# EAGLE design FM-Radio-Simple-Receiver-Dip1 (EAGLE 7.2.0)
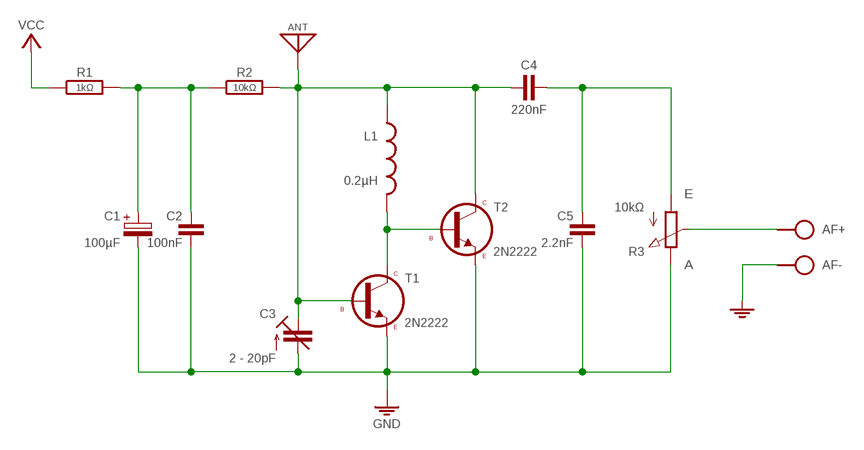
[diagram p0: schematic, sheet 1]

## Parts
AF  SPAD+--+  [SPAD-+]
ANT  ANT  [SPAD]
BAT  VCC_GNDL  [SPAD-+]
C1  100µF  CPOLE2,5-5/V  [E2,5-5/V]
C2  100nF  C050-020X036/V  [C050-020X036/V]
C3  2 - 20pF  C-TR-PH201272222-808-2PIND  [TRIM-2222-808]
C4  220nF  C-H050-020X044  [C050-020X044]
C5  2.2nF  C050-020X036/V  [C050-020X036/V]
L1  0.2µH  L10/10Y  [L-10/10Y]
R1  1kΩ  R-H0204/10  [0204/10]
R2  10kΩ  R-H0204/10  [0204/10]
R3  10kΩ  POT-3P  [CONN-3P]
T1  2N2222  [TO92]
T2  2N2222  [TO92]

## Nets
GND: AF.1 BAT.1 C1.- C2.2 C3.2(A) C5.2 R3.3(E) T1.1(E) T2.1(E)
N$1: ANT.1 C3.3(E) C4.1 L1.P$1 R2.2 T1.2(B) T2.3(C)
N$2: C1.+ C2.1 R1.2 R2.1
N$3: C4.2 C5.1 R3.1(A)
N$5: L1.P$2 T1.3(C) T2.2(B)
N$6: AF.2 R3.2(S)
VCC: BAT.2 R1.1

## Library data of the parts
AF = pad:SPAD+-
ANT = pad:ANT
BAT = pad:VCC_GND
C1 = c:CPOL: POLARIZED CAPACITOR, European symbol
C2 C5 = c:C: CAPACITOR, European symbol
C3 = cap-trim:C-TR-PH20127
C4 = c:C-H
L1 = l:L: Potentiometers Beckman, Copal, Piher, Spectrol, Schukat Created by librarian@cadsoft.de
R1 R2 = r:R-H
R3 = r:POT
T1 T2 = t:2N2222

## Net classes
0 default: width 0.813 mm, clearance 0.813 mm

## Board
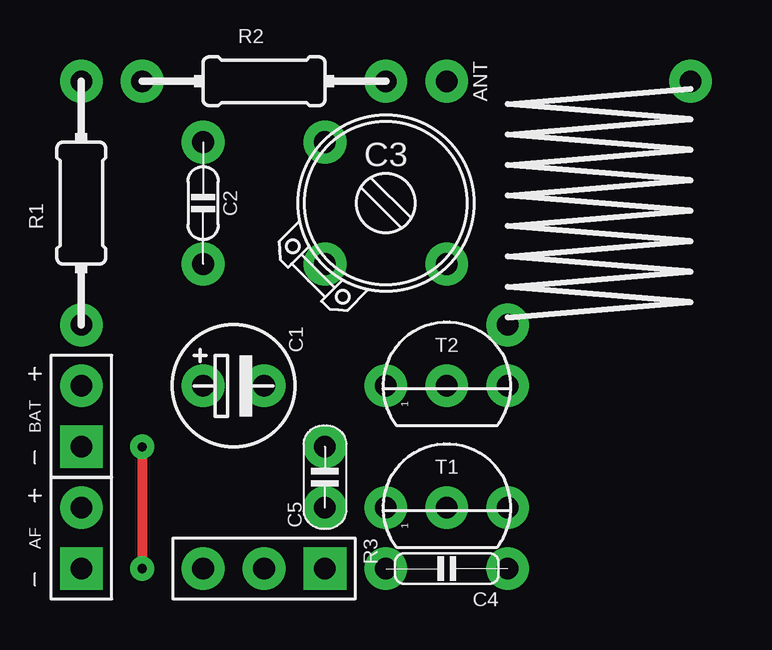
[diagram p1: board, top side]
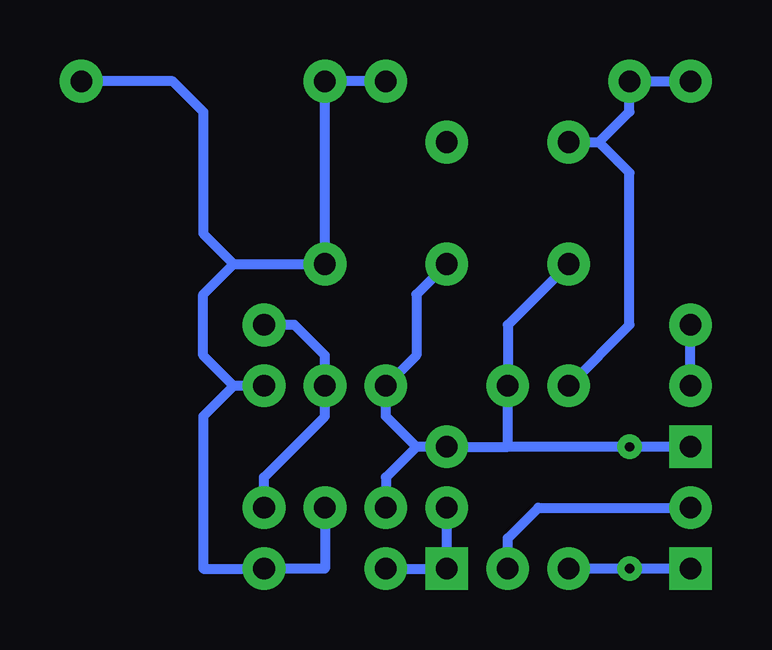
[diagram p2: board, bottom side, seen from below]

No outline drawn. Coordinates in mm, seen from the top.
Copper layers (1*16): Top 0.035mm / dielectric 1.5mm / Bottom 0.035mm
Design rules "default *": minimum track width 10mil, minimum drill 0.61mm, track to track 8mil, track to pad 8mil, pad to pad 8mil, via to via 8mil, smd to smd 8mil, copper to edge 40mil, drill to drill 8mil, minimum pad ring 0mil, minimum via ring 8mil, stop-mask expansion 2mil, vias tented up to drill 15mil, thermal gap 10mil

### Footprints (pad centres in the part's own frame; a part is rotated, then mirrored left to right if it is on the bottom)
SPAD-+ = drill 0.9 pad 1.778 square: 1 0,-1.27 | drill 0.9 pad 1.778: 2 0,1.27
SPAD = drill 0.9 pad 1.778: 1 0,0
E2,5-5/V = drill 0.9 pad 1.778: + 0,-1.27; - 0,1.27
C050-020X036/V = drill 0.9 pad 1.778: 1 0,-2.54; 2 0,2.54
TRIM-2222-808 = drill 0.9 pad 1.778: 1 -2.54,2.54; 2 -2.54,-2.54; 3 2.54,-2.54
C050-020X044 = drill 0.9 pad 1.778: 1 -2.54,0; 2 2.54,0
C025-020X036 = drill 0.9 pad 1.778: 1 0,0; 2 2.54,0
L-10/10Y = drill 0.9 pad 1.778: P$1 5.08,2.54; P$2 -2.54,-7.62
0204/10 = drill 0.9 pad 1.778: 1 -5.08,0; 2 5.08,0
CONN-3P = drill 0.9 pad 1.778 square: 1 0,2.54 | drill 0.9 pad 1.778: 2 0,0; 3 0,-2.54
TO92 = drill 0.9 pad 1.778: 1 0,2.54; 2 0,0; 3 0,-2.54

### Placement (x,y rotation side)
AF  2.54,3.81 0 top
ANT  17.78,22.86 180 top
BAT  2.54,8.89 0 top
C1  8.89,10.16 270 top
C2  7.62,17.78 180 top
C3  15.24,17.78 0 top
C4  17.78,2.54 180 top
C5  2.2nF  [C025-020X036]  12.7,5.08 90 top
L1  22.86,20.32 0 top
R1  2.54,17.78 90 top
R2  10.16,22.86 0 top
R3  10.16,2.54 270 top
T1  17.78,5.08 90 top
T2  17.78,10.16 90 top

### Tracks (layer width: path | path; a pad name or v marks a point on that pad's centre or on a via)
GND  (via drill 0.38 pad 1.02)
  Top 0.406: v5.08,7.62 v5.08,2.54
  Bottom 0.406: AF.1 v5.08,2.54 R3.3 | BAT.1 v5.08,7.62 10.16,7.62 | 10.16,7.62 C5.2 13.97,7.62 | 10.16,7.62 C1.- 10.16,12.7 C2.2 | 13.97,7.62 15.24,8.89 T2.1 13.97,11.43 13.97,13.97 C3.2 | 13.97,7.62 15.24,6.35 T1.1
N$1
  Bottom 0.406: 21.59,15.24 22.86,16.51 22.86,21.59 24.13,22.86 L1.P$1 | 21.59,10.16 22.86,8.89 22.86,2.54 C4.1 17.78,2.54 T1.2 | R2.2 ANT.1 C3.3 21.59,15.24 | T2.3 21.59,10.16 | 21.59,10.16 22.86,11.43 22.86,13.97 21.59,15.24
N$2
  Bottom 0.406: 6.35,20.32 5.08,19.05 5.08,12.7 C1.+ | C2.1 6.35,20.32 | 6.35,20.32 5.08,21.59 R2.1 R1.2
N$3
  Bottom 0.406: C4.2 R3.1 C5.1
N$5
  Bottom 0.406: T1.3 20.32,6.35 17.78,8.89 T2.2 17.78,11.43 19.05,12.7 L1.P$2
N$6
  Bottom 0.406: R3.2 10.16,3.81 8.89,5.08 AF.2
VCC
  Bottom 0.406: BAT.2 R1.1